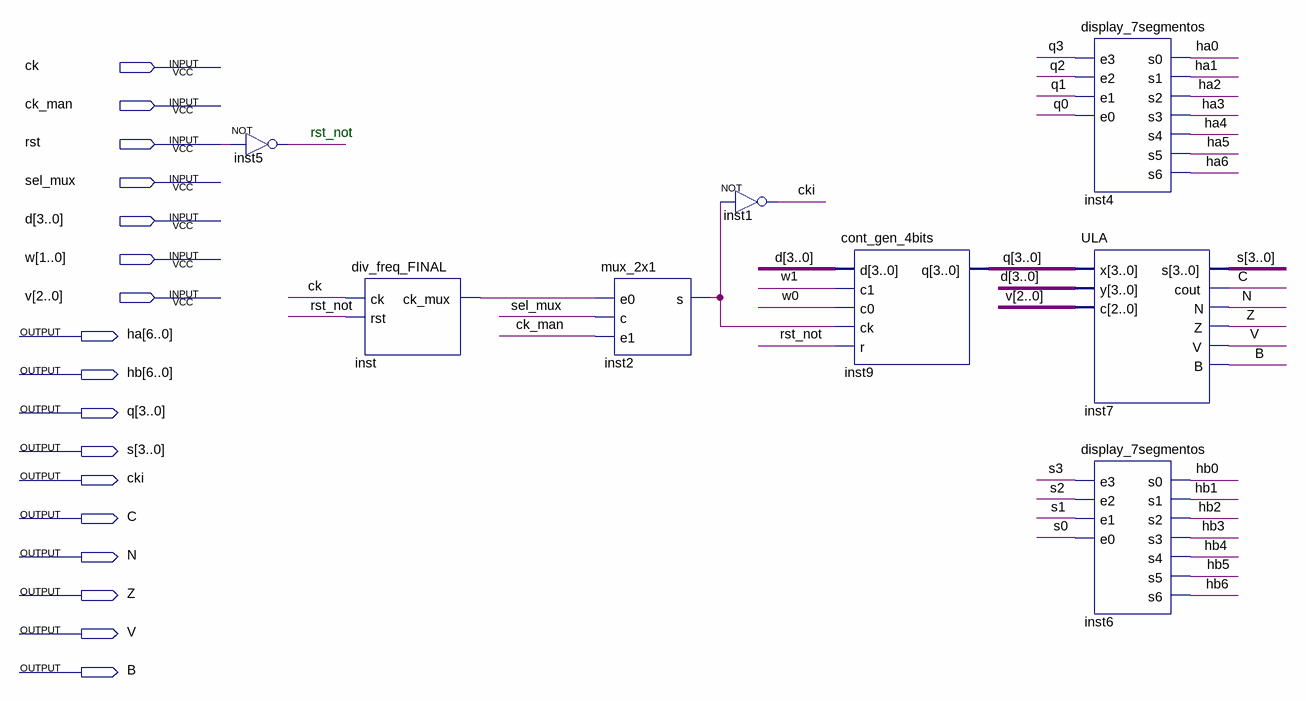
[diagram p0: schematic sheet]
// Quartus schematic ProjetoFinalCD.bdf as structural Verilog: 8 symbols, 17 pins
module ProjetoFinalCD (
  input  ck,
  input  ck_man,
  input  rst,
  input  sel_mux,
  input  [3:0] d,
  input  [1:0] w,
  input  [2:0] v,
  output [6:0] ha,
  output [6:0] hb,
  output [3:0] q,
  output [3:0] s,
  output cki,
  output C,
  output N,
  output Z,
  output v_1bit,
  output B
);

  wire inst2_s, inst_ck_mux, rst_not;

  not inst5 (rst_not, rst);
  div_freq_FINAL inst (.ck(ck), .rst(rst_not), .ck_mux(inst_ck_mux));
  mux_2x1 inst2 (.e0(inst_ck_mux), .c(sel_mux), .e1(ck_man), .s(inst2_s));
  not inst1 (cki, inst2_s);
  cont_gen_4bits inst9 (.d(d), .c1(w[1]), .c0(w[0]), .ck(inst2_s), .r(rst_not), .q(q));
  display_7segmentos inst4 (
    .e3(q[3]), .e2(q[2]), .e1(q[1]), .e0(q[0]), .s0(ha[0]), .s1(ha[1]), .s2(ha[2]), .s3(ha[3]), .s4(ha[4]),
    .s5(ha[5]), .s6(ha[6]));
  ULA inst7 (.x(q), .y(d), .c(v), .s(s), .cout(C), .N(N), .Z(Z), .V(v_1bit), .B(B));
  display_7segmentos inst6 (
    .e3(s[3]), .e2(s[2]), .e1(s[1]), .e0(s[0]), .s0(hb[0]), .s1(hb[1]), .s2(hb[2]), .s3(hb[3]), .s4(hb[4]),
    .s5(hb[5]), .s6(hb[6]));

  // Notes on the sheet:
  //   rst_not
endmodule
